# Altium schematic sheet Version_2018_01.SchDoc
size A3
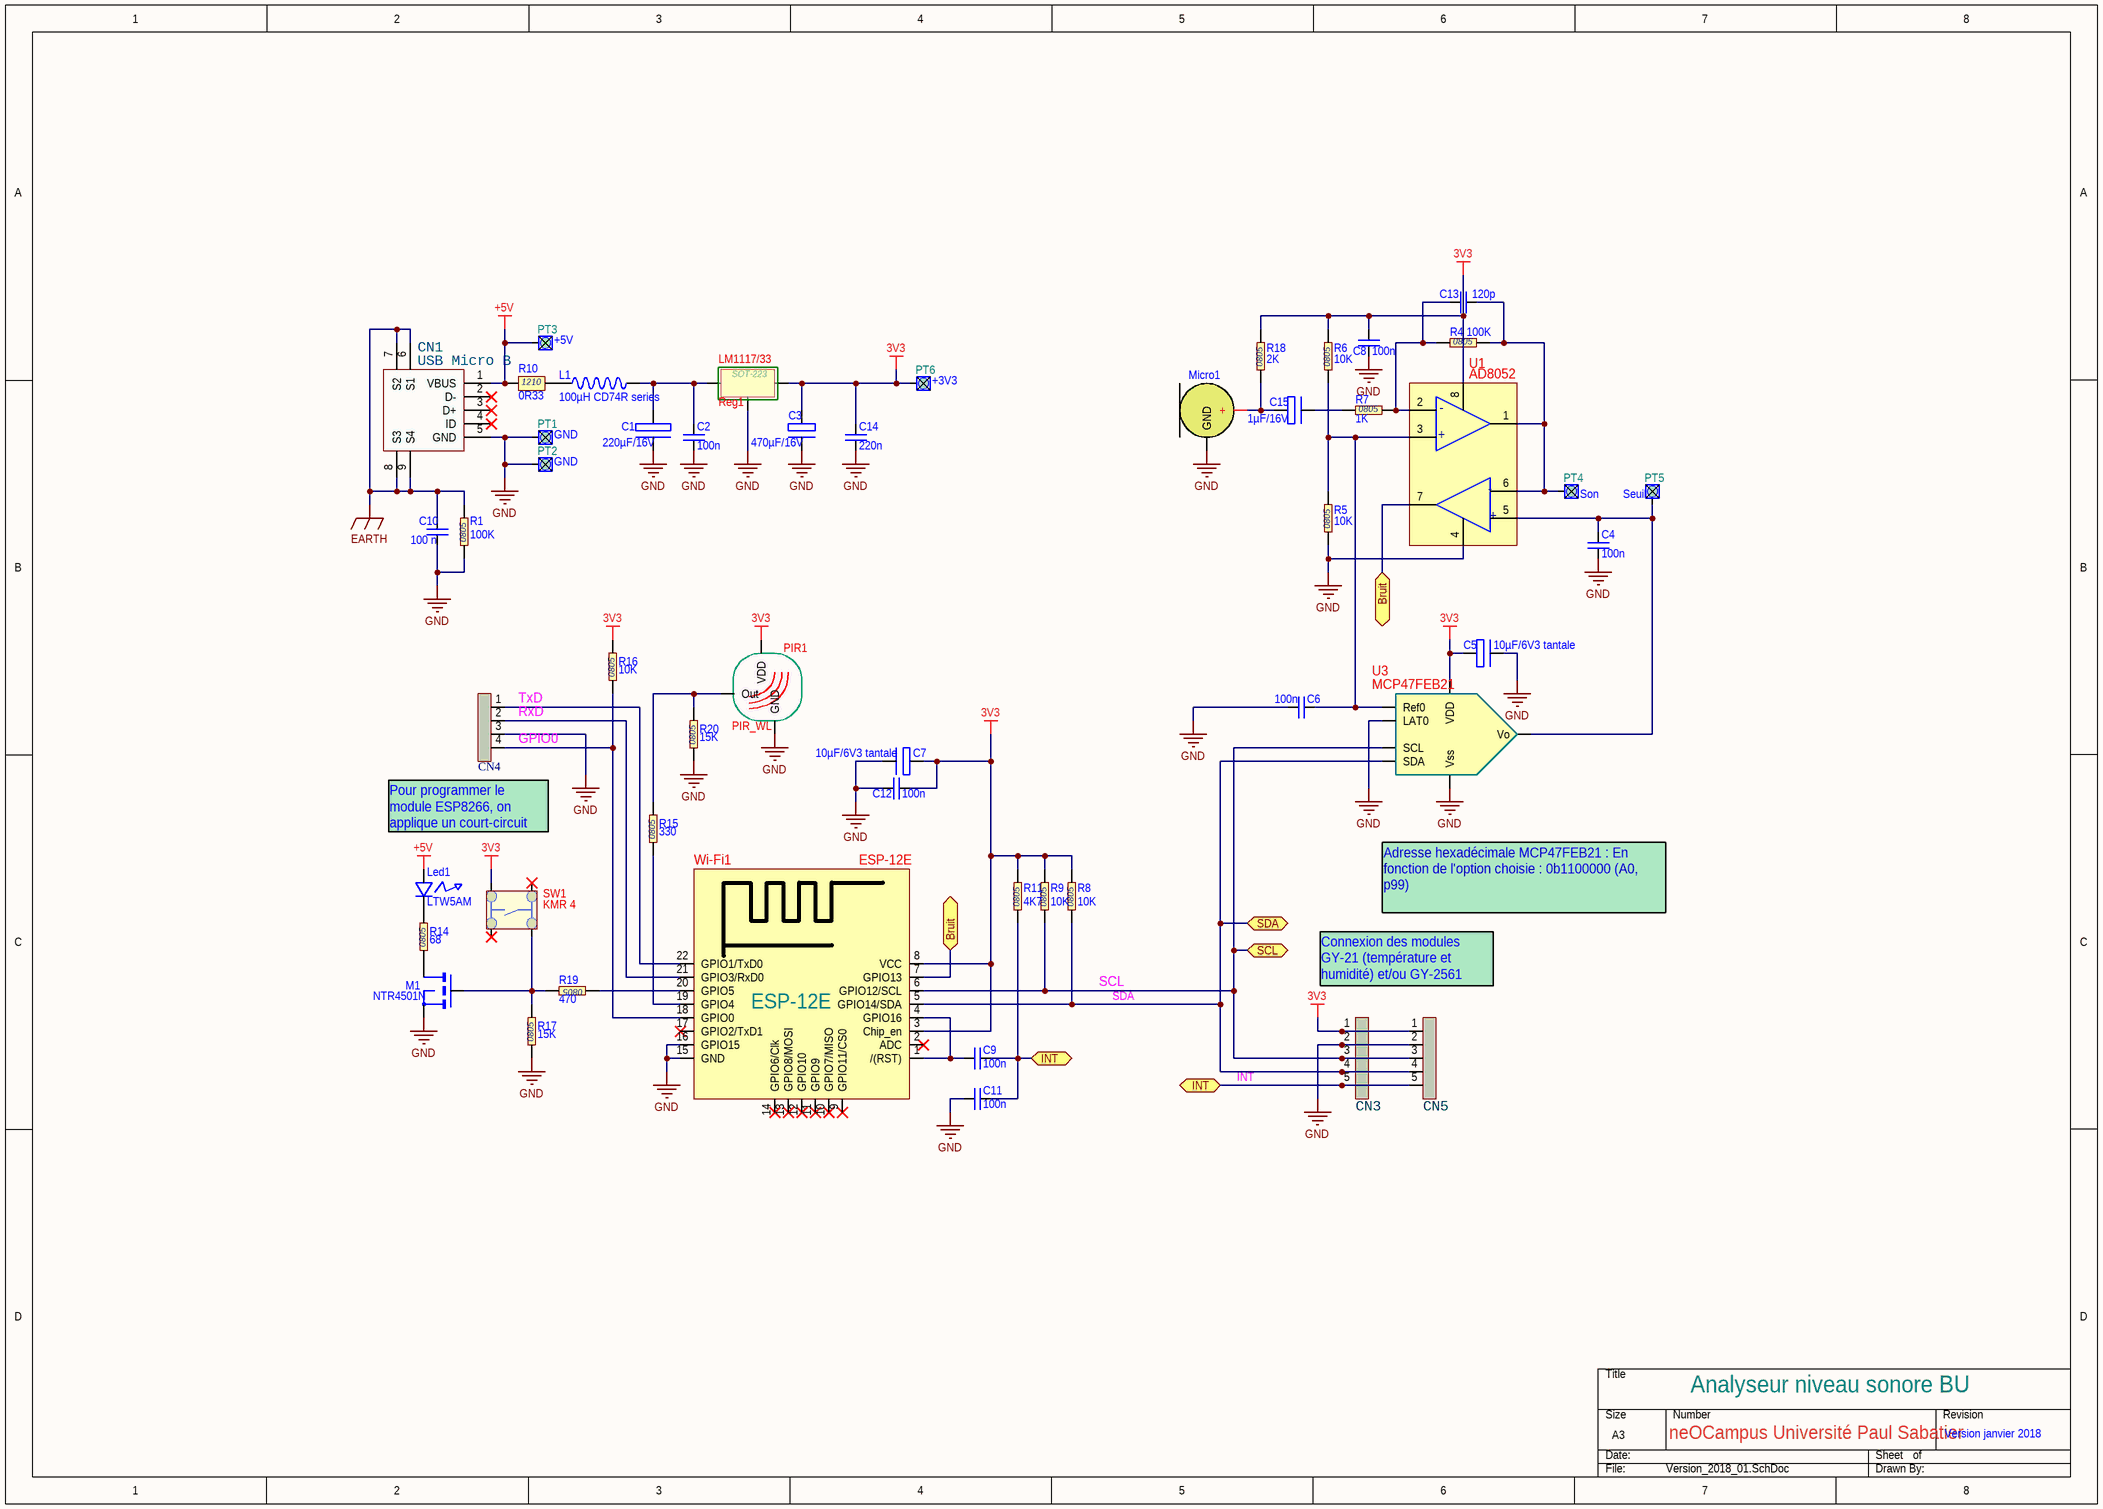
[diagram p0: Version_2018_01.SchDoc]

## Parts
C1  220µF/16V  [7343-31]
C2  100n  [0805]
C3  470µF/16V  [47µF/16V]
C4  100n  [0805]
C5  10µF/6V3 tantale  [Tantale 10µF/6V3]
C6  100n  [0805]
C7  10µF/6V3 tantale  [Tantale 10µF/6V3]
C8  100n  [0805]
C9  100n  [0805]
C10  100 n  [0805]
C11  100n  [0805]
C12  100n  [0805]
C13  120p  [0805]
C14  220n  [0805]
C15  1µF/16V  [3216-18]
CN1  USB Micro B  [USB Micro 714-2347]
CN3  inch_ligne 1x5  [INCH_1x5_droit]  (value not drawn)
CN4  inch_ligne 1x4  [INCH_1x4_droit]  (value not drawn)
CN5  inch_ligne 1x5  [INCH_1x5_droit]  (value not drawn)
L1  100µH CD74R series  [SELF CD74R]
Led1  LTW5AM  [LTW5AM]
M1  NTR4501N  [SOT23 (NTR4501)]
Micro1  Electret  [Micro_electret simple]  (value not drawn)
PIR1  PIR_WL  [PIR_WL]
PT1  GND  [PTEST boucle]
PT2  GND  [PTEST boucle]
PT3  +5V  [PTEST boucle]
PT4  Son  [PTEST boucle]
PT5  Seuil  [PTEST boucle]
PT6  +3V3  [PTEST boucle]
R1  100K  [0805]
R4  100K  [0805]
R5  10K  [0805]
R6  10K  [0805]
R7  1K  [0805]
R8  10K  [0805]
R9  10K  [0805]
R10  0R33  [1210]
R11  4K7  [0805]
R14  68  [0805]
R15  330  [0805]
R16  10K  [0805]
R17  15K  [0805]
R18  2K  [0805]
R19  470  [0805]
R20  15K  [0805]
Reg1  LM1117/33  [SOT-223 thermo1]
SW1  KMR 4  [µSwitch KMR4]
U1  AD8052  [SOIC08]
U3  MCP47FEB21  [TSSOP_8]
Wi-Fi1  ESP-12E  [ESP-12E]

## Ports
Bruit, INT, SCL, SDA

## Nets
3V3: C3.1(V+) C5.1(V+) C7.1(V+) C8.2(CT2) C12.2(CT2) C14.2(CT2) CN3.1 CN5.1 PIR1.1(VDD) PT6.1(PIN) R6.2(CT2) R8.2(CT2) R9.2(CT2) R11.2(CT2) R16.2(CT2) R18.2(CT2) Reg1.2(OUT) SW1.2(CT2) U1.8(V+) U3.1(VDD) Wi-Fi1.3(Chip_en) Wi-Fi1.8(VCC)
+5V: CN1.1(VBUS) Led1.1(anode) PT3.1(PIN) R10.1(CT1)
EARTH: C10.2(CT2) CN1.6(S1) CN1.7(S2) CN1.8(S3) CN1.9(S4) R1.2(CT2)
GND: C1.2(V-) C2.1(CT1) C3.2(V-) C4.1(CT1) C5.2(V-) C6.2(CT2) C7.2(V-) C8.1(CT1) C10.1(CT1) C11.1(CT1) C12.1(CT1) C14.1(CT1) CN1.5(GND) CN3.2 CN4.3 CN5.2 M1.3(S) Micro1.0(GND) PIR1.3(GND) PT1.1(PIN) PT2.1(PIN) R1.1(CT1) R5.1(CT1) R17.1(CT1) R20.1(CT1) Reg1.1(GND) U1.4(V-) U3.5(Vss) U3.6(LAT0) Wi-Fi1.15(GND) Wi-Fi1.16(GPIO15)
Bruit: U1.7(out) Wi-Fi1.7(GPIO13) ; port Bruit
GPIO0: CN4.4 R16.1(CT1) Wi-Fi1.18(GPIO0)
INT: C9.1(CT1) C11.2(CT2) CN3.5 CN5.5 R11.1(CT1) ; port INT
RxD: CN4.2 Wi-Fi1.21(GPIO3/RxD0)
SCL: CN3.3 CN5.3 R9.1(CT1) U3.7(SCL) Wi-Fi1.6(GPIO12/SCL) ; port SCL
SDA: CN3.4 CN5.4 R8.1(CT1) U3.8(SDA) Wi-Fi1.5(GPIO14/SDA) ; port SDA
TxD: CN4.1 Wi-Fi1.22(GPIO1/TxD0)
NetC1_1: C1.1(V+) C2.2(CT2) L1.1(CT1) Reg1.3(IN)
NetC4_2: C4.2(CT2) PT5.1(PIN) U1.5(in+) U3.3(Vo)
NetC6_1: C6.1(CT1) R5.2(CT2) R6.1(CT1) U1.3(in+) U3.2(Ref0)
NetC9_2: C9.2(CT2) Wi-Fi1.1(/(RST)) Wi-Fi1.4(GPIO16)
NetC13_1: C13.1(CT1) R4.1(CT1) R7.2(CT2) U1.2(in-)
NetC13_2: C13.2(CT2) PT4.1(PIN) R4.2(CT2) U1.1(out) U1.6(in-)
NetC15_1: C15.1(V+) Micro1.1(+) R18.1(CT1)
NetC15_2: C15.2(V-) R7.1(CT1)
NetL1_2: L1.2(CT2) R10.2(CT2)
NetLed1_2: Led1.2(cathode) R14.2(CT2)
NetM1_1: M1.1(D) R14.1(CT1)
NetM1_2: M1.2(G) R17.2(CT2) R19.2(CT2) SW1.3(CT3)
NetPIR1_2: PIR1.2(Out) R15.2(CT2) R20.2(CT2)
NetR15_1: R15.1(CT1) Wi-Fi1.19(GPIO4)
NetR19_1: R19.1(CT1) Wi-Fi1.20(GPIO5)

Not connected (* = marked no-connect by the designer): CN1 2(D-)* 3(D+)* 4(ID)*; SW1 1(CT1)* 4(CT4)*; Wi-Fi1 2(ADC)* 9(GPIO11/CS0)* 10(GPIO7/MISO)* 11(GPIO9)* 12(GPIO10)* 13(GPIO8/MOSI)* 14(GPIO6/Clk)* 17(GPIO2/TxD1)*

## Notes on the sheet
- Pour programmer le module ESP8266, on applique un court-circuit entre 3 et 4.
- Adresse hexadécimale MCP47FEB21 : En fonction de l'option choisie : 0b1100000 (A0, p99)
  Adresse hexadécimale MCP9808 : 0x3_
- Connexion des modules GY-21 (température et humidité) et/ou GY-2561 (Luxmètre)
- Analyseur niveau sonore BU
- neOCampus Université Paul Sabatier
- Version janvier 2018
- (in symbol AD8052) -; +
- (in symbol LM1117MPX-3.3) SOT-223
- (in symbol Res CMS 0805) 0805
- (in symbol Res CMS 1210 ERJ14B) 1210

## Library data of the parts
C1 = tantale 220µF/16V: 253-5290 case 7343-31
C2 C4 C6 C8-C14 = Cap_CMS_0805: CMS 0805
C3 = 47µF/16V: électrochimique diam. 6,3mm 128-1810
C5 C7 = tantale 10µF/6V3: 175-4041 ou 145-7412 case 3216-18
C15 = tantale 1µF/16V: 145-7406 case 3216-18
CN1 = USB Micro B: Amphenol 714-2347
CN3 CN5 = Inch_1x5_droit
CN4 = Inch_1x4_droit
L1 = Self CD74R: SMT CD74R Aliexpress
Led1 = LTW5AM LED: LED Golden Dragon Plus
M1 = NTR4501N: MOSFET canal N
Micro1 = Microphone_03: Microphone électret
PIR1 = PIR_01: Détecteur infrarouge
PT1-PT6 = PTEST boucle: pointe de test CI 262-2179
R1 R4-R9 R11 R14-R20 = Res CMS 0805: CMS 0805
R10 = Res CMS 1210 ERJ14B: CMS 1210
Reg1 = LM1117MPX-3.3: Régulateur SOT-223
SW1 = µSwitch: KMR 4 Series 793-1605
U1 = AD8052: AOP
U3 = MCP47FEB21: DAC I2C (RS : 879-3261)
Wi-Fi1 = ESP-12E: ESP-12E module Wi-Fi